# Altium project relay.PrjPCB
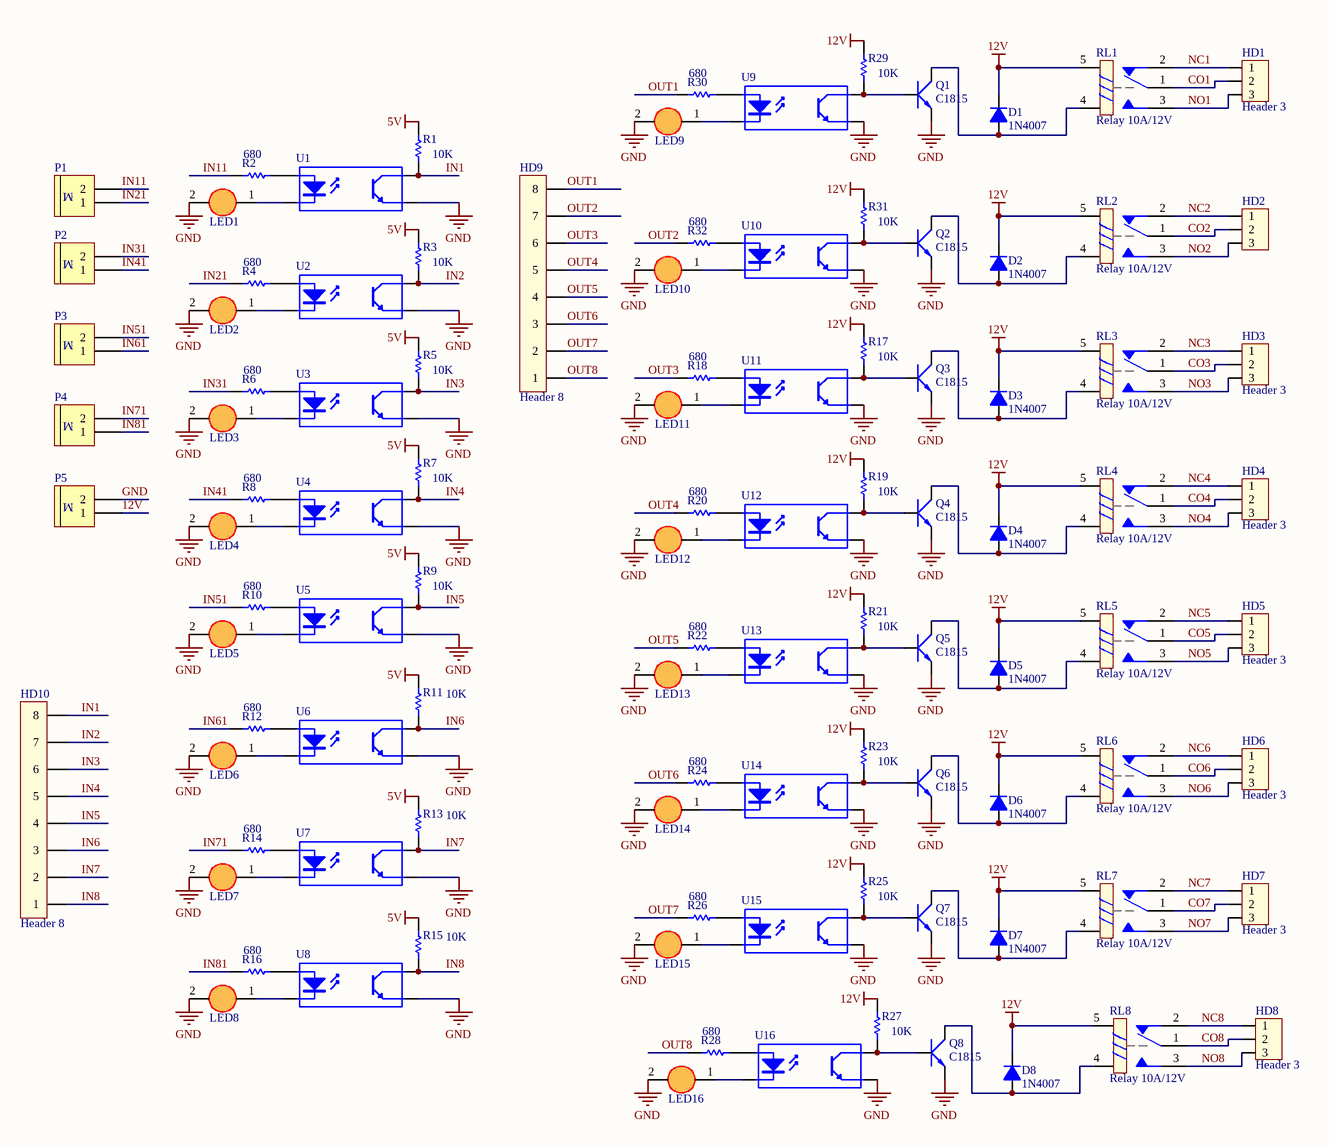
[diagram p0: nguyen ly.SchDoc]
1 sheet, 103 parts. Net scope: global (net labels, ports and power ports of the same name join across sheets).
Board file: MACH IN.PcbDoc

## Sheet nguyen ly.SchDoc
size B

### Parts
D1  1N4007  [D1A]
D2  1N4007  [D1A]
D3  1N4007  [D1A]
D4  1N4007  [D1A]
D5  1N4007  [D1A]
D6  1N4007  [D1A]
D7  1N4007  [D1A]
D8  1N4007  [D1A]
HD1  Header 3  [HED3]
HD2  Header 3  [HED3]  (value not drawn)
HD3  Header 3  [HED3]
HD4  Header 3  [HED3]
HD5  Header 3  [HED3]
HD6  Header 3  [HED3]
HD7  Header 3  [HED3]
HD8  Header 3  [HED3]
HD9  Header 8  [HED8V]
HD10  Header 8  [HED8V]
LED1  LED3  [LED3mm]  (value not drawn)
LED2  LED3  [LED3mm]  (value not drawn)
LED3  LED3  [LED3mm]  (value not drawn)
LED4  LED3  [LED3mm]  (value not drawn)
LED5  LED3  [LED3mm]  (value not drawn)
LED6  LED3  [LED3mm]  (value not drawn)
LED7  LED3  [LED3mm]  (value not drawn)
LED8  LED3  [LED3mm]  (value not drawn)
LED9  LED3  [LED3mm]  (value not drawn)
LED10  LED3  [LED3mm]  (value not drawn)
LED11  LED3  [LED3mm]  (value not drawn)
LED12  LED3  [LED3mm]  (value not drawn)
LED13  LED3  [LED3mm]  (value not drawn)
LED14  LED3  [LED3mm]  (value not drawn)
LED15  LED3  [LED3mm]  (value not drawn)
LED16  LED3  [LED3mm]  (value not drawn)
P1  Header 2 - M  [Medium - Header 2]  (value not drawn)
P2  Header 2 - M  [Medium - Header 2]  (value not drawn)
P3  Header 2 - M  [Medium - Header 2]  (value not drawn)
P4  Header 2 - M  [Medium - Header 2]  (value not drawn)
P5  Header 2 - M  [Medium - Header 2]  (value not drawn)
Q1  C1815  [QTO-92]
Q2  C1815  [QTO-92]
Q3  C1815  [QTO-92]
Q4  C1815  [QTO-92]
Q5  C1815  [QTO-92]
Q6  C1815  [QTO-92]
Q7  C1815  [QTO-92]
Q8  C1815  [QTO-92]
R1  value 10K  [AXIAL-0.3]  (hidden comment: Res1)
R2  value 680  [AXIAL-0.3]  (hidden comment: Res1)
R3  value 10K  [AXIAL-0.3]  (hidden comment: Res1)
R4  value 680  [AXIAL-0.3]  (hidden comment: Res1)
R5  value 10K  [AXIAL-0.3]  (hidden comment: Res1)
R6  value 680  [AXIAL-0.3]  (hidden comment: Res1)
R7  value 10K  [AXIAL-0.3]  (hidden comment: Res1)
R8  value 680  [AXIAL-0.3]  (hidden comment: Res1)
R9  value 10K  [AXIAL-0.3]  (hidden comment: Res1)
R10  value 680  [AXIAL-0.3]  (hidden comment: Res1)
R11  value 10K  [AXIAL-0.3]  (hidden comment: Res1)
R12  value 680  [AXIAL-0.3]  (hidden comment: Res1)
R13  value 10K  [AXIAL-0.3]  (hidden comment: Res1)
R14  value 680  [AXIAL-0.3]  (hidden comment: Res1)
R15  value 10K  [AXIAL-0.3]  (hidden comment: Res1)
R16  value 680  [AXIAL-0.3]  (hidden comment: Res1)
R17  value 10K  [AXIAL-0.3]  (hidden comment: Res1)
R18  value 680  [AXIAL-0.3]  (hidden comment: Res1)
R19  value 10K  [AXIAL-0.3]  (hidden comment: Res1)
R20  value 680  [AXIAL-0.3]  (hidden comment: Res1)
R21  value 10K  [AXIAL-0.3]  (hidden comment: Res1)
R22  value 680  [AXIAL-0.3]  (hidden comment: Res1)
R23  value 10K  [AXIAL-0.3]  (hidden comment: Res1)
R24  value 680  [AXIAL-0.3]  (hidden comment: Res1)
R25  value 10K  [AXIAL-0.3]  (hidden comment: Res1)
R26  value 680  [AXIAL-0.3]  (hidden comment: Res1)
R27  value 10K  [AXIAL-0.3]  (hidden comment: Res1)
R28  value 680  [AXIAL-0.3]  (hidden comment: Res1)
R29  value 10K  [AXIAL-0.3]  (hidden comment: Res1)
R30  value 680  [AXIAL-0.3]  (hidden comment: Res1)
R31  value 10K  [AXIAL-0.3]  (hidden comment: Res1)
R32  value 680  [AXIAL-0.3]  (hidden comment: Res1)
RL1  Relay 10A/12V  [RL_SPDT_10A]
RL2  Relay 10A/12V  [RL_SPDT_10A]
RL3  Relay 10A/12V  [RL_SPDT_10A]
RL4  Relay 10A/12V  [RL_SPDT_10A]
RL5  Relay 10A/12V  [RL_SPDT_10A]
RL6  Relay 10A/12V  [RL_SPDT_10A]
RL7  Relay 10A/12V  [RL_SPDT_10A]
RL8  Relay 10A/12V  [RL_SPDT_10A]
U1  Optoisolator1  [DIP-4]  (value not drawn)
U2  Optoisolator1  [DIP-4]  (value not drawn)
U3  Optoisolator1  [DIP-4]  (value not drawn)
U4  Optoisolator1  [DIP-4]  (value not drawn)
U5  Optoisolator1  [DIP-4]  (value not drawn)
U6  Optoisolator1  [DIP-4]  (value not drawn)
U7  Optoisolator1  [DIP-4]  (value not drawn)
U8  Optoisolator1  [DIP-4]  (value not drawn)
U9  Optoisolator1  [DIP-4]  (value not drawn)
U10  Optoisolator1  [DIP-4]  (value not drawn)
U11  Optoisolator1  [DIP-4]  (value not drawn)
U12  Optoisolator1  [DIP-4]  (value not drawn)
U13  Optoisolator1  [DIP-4]  (value not drawn)
U14  Optoisolator1  [DIP-4]  (value not drawn)
U15  Optoisolator1  [DIP-4]  (value not drawn)
U16  Optoisolator1  [DIP-4]  (value not drawn)

### Nets
5V: R1.2 R3.2 R5.2 R7.2 R9.2 R11.2 R13.2 R15.2
12V: D1.2(K) D2.2(K) D3.2(K) D4.2(K) D5.2(K) D6.2(K) D7.2(K) D8.2(K) P5.1 R17.2 R19.2 R21.2 R23.2 R25.2 R27.2 R29.2 R31.2 RL1.5 RL2.5 RL3.5 RL4.5 RL5.5 RL6.5 RL7.5 RL8.5
GND: LED1.2(K) LED2.2(K) LED3.2(K) LED4.2(K) LED5.2(K) LED6.2(K) LED7.2(K) LED8.2(K) LED9.2(K) LED10.2(K) LED11.2(K) LED12.2(K) LED13.2(K) LED14.2(K) LED15.2(K) LED16.2(K) P5.2 Q1.1(E) Q2.1(E) Q3.1(E) Q4.1(E) Q5.1(E) Q6.1(E) Q7.1(E) Q8.1(E) U1.3(E) U2.3(E) U3.3(E) U4.3(E) U5.3(E) U6.3(E) U7.3(E) U8.3(E) U9.3(E) U10.3(E) U11.3(E) U12.3(E) U13.3(E) U14.3(E) U15.3(E) U16.3(E)
CO1: HD1.2 RL1.1
CO2: HD2.2 RL2.1
CO3: HD3.2 RL3.1
CO4: HD4.2 RL4.1
CO5: HD5.2 RL5.1
CO6: HD6.2 RL6.1
CO7: HD7.2 RL7.1
CO8: HD8.2 RL8.1
IN1: HD10.8 R1.1 U1.4(C)
IN2: HD10.7 R3.1 U2.4(C)
IN3: HD10.6 R5.1 U3.4(C)
IN4: HD10.5 R7.1 U4.4(C)
IN5: HD10.4 R9.1 U5.4(C)
IN6: HD10.3 R11.1 U6.4(C)
IN7: HD10.2 R13.1 U7.4(C)
IN8: HD10.1 R15.1 U8.4(C)
IN11: P1.2 R2.1
IN21: P1.1 R4.1
IN31: P2.2 R6.1
IN41: P2.1 R8.1
IN51: P3.2 R10.1
IN61: P3.1 R12.1
IN71: P4.2 R14.1
IN81: P4.1 R16.1
NC1: HD1.1 RL1.2
NC2: HD2.1 RL2.2
NC3: HD3.1 RL3.2
NC4: HD4.1 RL4.2
NC5: HD5.1 RL5.2
NC6: HD6.1 RL6.2
NC7: HD7.1 RL7.2
NC8: HD8.1 RL8.2
NO1: HD1.3 RL1.3
NO2: HD2.3 RL2.3
NO3: HD3.3 RL3.3
NO4: HD4.3 RL4.3
NO5: HD5.3 RL5.3
NO6: HD6.3 RL6.3
NO7: HD7.3 RL7.3
NO8: HD8.3 RL8.3
OUT1: HD9.8 R30.1
OUT2: HD9.7 R32.1
OUT3: HD9.6 R18.1
OUT4: HD9.5 R20.1
OUT5: HD9.4 R22.1
OUT6: HD9.3 R24.1
OUT7: HD9.2 R26.1
OUT8: HD9.1 R28.1
NetD1_1: D1.1(A) Q1.2(C) RL1.4
NetD2_1: D2.1(A) Q2.2(C) RL2.4
NetD3_1: D3.1(A) Q3.2(C) RL3.4
NetD4_1: D4.1(A) Q4.2(C) RL4.4
NetD5_1: D5.1(A) Q5.2(C) RL5.4
NetD6_1: D6.1(A) Q6.2(C) RL6.4
NetD7_1: D7.1(A) Q7.2(C) RL7.4
NetD8_1: D8.1(A) Q8.2(C) RL8.4
NetLED1_1: LED1.1(A) U1.2(K)
NetLED2_1: LED2.1(A) U2.2(K)
NetLED3_1: LED3.1(A) U3.2(K)
NetLED4_1: LED4.1(A) U4.2(K)
NetLED5_1: LED5.1(A) U5.2(K)
NetLED6_1: LED6.1(A) U6.2(K)
NetLED7_1: LED7.1(A) U7.2(K)
NetLED8_1: LED8.1(A) U8.2(K)
NetLED9_1: LED9.1(A) U9.2(K)
NetLED10_1: LED10.1(A) U10.2(K)
NetLED11_1: LED11.1(A) U11.2(K)
NetLED12_1: LED12.1(A) U12.2(K)
NetLED13_1: LED13.1(A) U13.2(K)
NetLED14_1: LED14.1(A) U14.2(K)
NetLED15_1: LED15.1(A) U15.2(K)
NetLED16_1: LED16.1(A) U16.2(K)
NetQ1_3: Q1.3(B) R29.1 U9.4(C)
NetQ2_3: Q2.3(B) R31.1 U10.4(C)
NetQ3_3: Q3.3(B) R17.1 U11.4(C)
NetQ4_3: Q4.3(B) R19.1 U12.4(C)
NetQ5_3: Q5.3(B) R21.1 U13.4(C)
NetQ6_3: Q6.3(B) R23.1 U14.4(C)
NetQ7_3: Q7.3(B) R25.1 U15.4(C)
NetQ8_3: Q8.3(B) R27.1 U16.4(C)
NetR2_2: R2.2 U1.1(A)
NetR4_2: R4.2 U2.1(A)
NetR6_2: R6.2 U3.1(A)
NetR8_2: R8.2 U4.1(A)
NetR10_2: R10.2 U5.1(A)
NetR12_2: R12.2 U6.1(A)
NetR14_2: R14.2 U7.1(A)
NetR16_2: R16.2 U8.1(A)
NetR18_2: R18.2 U11.1(A)
NetR20_2: R20.2 U12.1(A)
NetR22_2: R22.2 U13.1(A)
NetR24_2: R24.2 U14.1(A)
NetR26_2: R26.2 U15.1(A)
NetR28_2: R28.2 U16.1(A)
NetR30_2: R30.2 U9.1(A)
NetR32_2: R32.2 U10.1(A)

### Notes on the sheet
- (in symbol Header 2 - M) M

### Library data of the parts
D1-D8 = D1A: Diode 1A; Value: 1N4007
HD1-HD8 = Hed3: Header 3 (Green); Value: Header 3
HD9 HD10 = HED8V: Header 8 Vit Broad
LED1-LED16 = LED 3mm
P1-P5 = Header 2 - M: Header, 2-Pin, Medium; LatestRevisionDate: 17-Jul-2002; LatestRevisionNote: Re-released for DXP Platform.; Publisher: Altium Limited
Q1-Q8 = C1815: NPN 600mW, ECB; Value: C1815
R1-R32 = Res1: Resistor; Published: 8-Jun-2000; LatestRevisionDate: 17-Jul-2002; LatestRevisionNote: Re-released for DXP Platform.; PackageReference: AXIAL-0.3; Publisher: Altium Limited; PackageDescription: Axial Device, Thru-Hole; 2 Leads; 0.3 in Pin Spacing
RL1-RL8 = Relay 1: Relay SPDT,10A - 12VDC 5 Pin; Value: Relay SPDT, 10A, 12V
U1-U16 = Optoisolator1: 4-Pin Phototransistor Optocoupler; Published: 24-Mar-1999; LatestRevisionDate: 04-Mar-2005; LatestRevisionNote: Sch pins 3 & 4 Swapped.; DatasheetVersion: Nov-2003; PackageReference: DIP-4; Publisher: Altium Limited